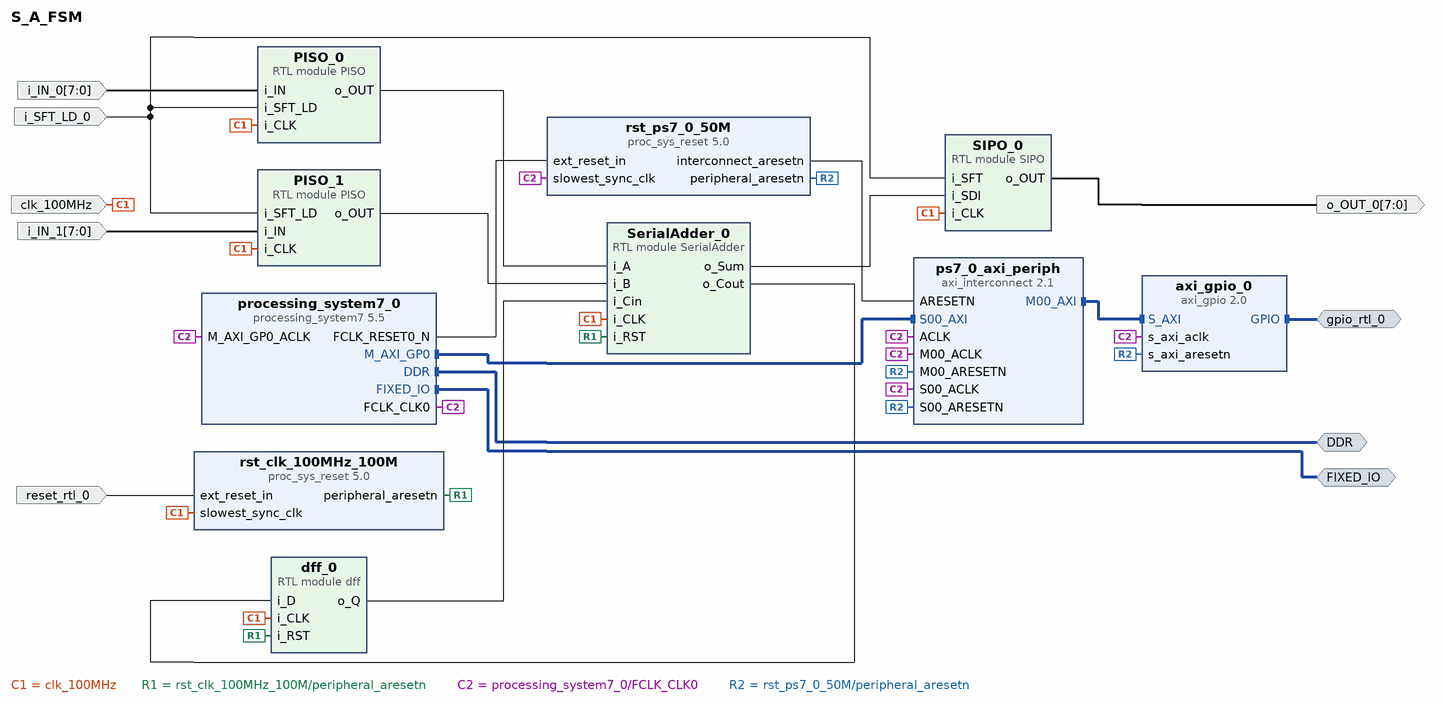
[diagram p0: block diagram of the top level]
# Vivado block design S_A_FSM, xc7z007sclg400-1, Vivado 2018.2
create_bd_design S_A_FSM

create_bd_intf_port -mode Master -vlnv xilinx.com:interface:gpio_rtl:1.0 gpio_rtl_0
create_bd_intf_port -mode Master -vlnv xilinx.com:interface:ddrx_rtl:1.0 DDR
create_bd_intf_port -mode Master -vlnv xilinx.com:display_processing_system7:fixedio_rtl:1.0 FIXED_IO
create_bd_port -dir I -type clk clk_100MHz
set_property -dict {CONFIG.FREQ_HZ 100000000} [get_bd_ports clk_100MHz]
create_bd_port -dir I -type rst reset_rtl_0
set_property -dict {CONFIG.POLARITY ACTIVE_LOW} [get_bd_ports reset_rtl_0]
create_bd_port -dir O -from 7 -to 0 o_OUT_0
create_bd_port -dir I -from 7 -to 0 i_IN_0
create_bd_port -dir I -from 7 -to 0 i_IN_1
create_bd_port -dir I i_SFT_LD_0

create_bd_cell -type ip -vlnv xilinx.com:ip:proc_sys_reset:5.0 rst_clk_100MHz_100M
create_bd_cell -type module -reference SIPO SIPO_0
create_bd_cell -type module -reference PISO PISO_0
create_bd_cell -type module -reference PISO PISO_1
create_bd_cell -type module -reference dff dff_0
create_bd_cell -type module -reference SerialAdder SerialAdder_0
create_bd_cell -type ip -vlnv xilinx.com:ip:axi_gpio:2.0 axi_gpio_0
create_bd_cell -type ip -vlnv xilinx.com:ip:processing_system7:5.5 processing_system7_0
create_bd_cell -type ip -vlnv xilinx.com:ip:axi_interconnect:2.1 ps7_0_axi_periph
set_property -dict {CONFIG.NUM_MI 1} [get_bd_cells ps7_0_axi_periph]
create_bd_cell -type ip -vlnv xilinx.com:ip:proc_sys_reset:5.0 rst_ps7_0_50M

# ---- connections ----

connect_bd_intf_net [get_bd_intf_pins processing_system7_0/M_AXI_GP0] [get_bd_intf_pins ps7_0_axi_periph/S00_AXI]
connect_bd_intf_net [get_bd_intf_pins ps7_0_axi_periph/M00_AXI] [get_bd_intf_pins axi_gpio_0/S_AXI]
connect_bd_intf_net [get_bd_intf_ports gpio_rtl_0] [get_bd_intf_pins axi_gpio_0/GPIO]
connect_bd_intf_net [get_bd_intf_ports DDR] [get_bd_intf_pins processing_system7_0/DDR]
connect_bd_intf_net [get_bd_intf_ports FIXED_IO] [get_bd_intf_pins processing_system7_0/FIXED_IO]
connect_bd_net [get_bd_ports clk_100MHz] \
  [get_bd_pins rst_clk_100MHz_100M/slowest_sync_clk] [get_bd_pins SIPO_0/i_CLK] [get_bd_pins PISO_0/i_CLK] \
  [get_bd_pins PISO_1/i_CLK] [get_bd_pins dff_0/i_CLK] [get_bd_pins SerialAdder_0/i_CLK]
connect_bd_net -net reset_rtl_0_1 [get_bd_ports reset_rtl_0] [get_bd_pins rst_clk_100MHz_100M/ext_reset_in]
connect_bd_net [get_bd_pins SerialAdder_0/o_Sum] [get_bd_pins SIPO_0/i_SDI]
connect_bd_net [get_bd_pins SIPO_0/o_OUT] [get_bd_ports o_OUT_0]
connect_bd_net [get_bd_pins PISO_0/o_OUT] [get_bd_pins SerialAdder_0/i_A]
connect_bd_net [get_bd_pins PISO_1/o_OUT] [get_bd_pins SerialAdder_0/i_B]
connect_bd_net -net i_IN_0_1 [get_bd_ports i_IN_0] [get_bd_pins PISO_0/i_IN]
connect_bd_net -net i_IN_1_1 [get_bd_ports i_IN_1] [get_bd_pins PISO_1/i_IN]
connect_bd_net -net i_SFT_LD_0_1 [get_bd_ports i_SFT_LD_0] [get_bd_pins PISO_1/i_SFT_LD] [get_bd_pins PISO_0/i_SFT_LD] [get_bd_pins SIPO_0/i_SFT]
connect_bd_net [get_bd_pins rst_clk_100MHz_100M/peripheral_aresetn] [get_bd_pins dff_0/i_RST] [get_bd_pins SerialAdder_0/i_RST]
connect_bd_net [get_bd_pins SerialAdder_0/o_Cout] [get_bd_pins dff_0/i_D]
connect_bd_net [get_bd_pins dff_0/o_Q] [get_bd_pins SerialAdder_0/i_Cin]
connect_bd_net [get_bd_pins processing_system7_0/FCLK_CLK0] \
  [get_bd_pins processing_system7_0/M_AXI_GP0_ACLK] [get_bd_pins ps7_0_axi_periph/S00_ACLK] \
  [get_bd_pins rst_ps7_0_50M/slowest_sync_clk] [get_bd_pins axi_gpio_0/s_axi_aclk] [get_bd_pins ps7_0_axi_periph/M00_ACLK] \
  [get_bd_pins ps7_0_axi_periph/ACLK]
connect_bd_net [get_bd_pins processing_system7_0/FCLK_RESET0_N] [get_bd_pins rst_ps7_0_50M/ext_reset_in]
connect_bd_net [get_bd_pins rst_ps7_0_50M/peripheral_aresetn] \
  [get_bd_pins ps7_0_axi_periph/S00_ARESETN] [get_bd_pins axi_gpio_0/s_axi_aresetn] \
  [get_bd_pins ps7_0_axi_periph/M00_ARESETN]
connect_bd_net [get_bd_pins rst_ps7_0_50M/interconnect_aresetn] [get_bd_pins ps7_0_axi_periph/ARESETN]

# ---- address map ----
assign_bd_address -offset 0x41200000 -range 64K -target_address_space [get_bd_addr_spaces processing_system7_0/Data] [get_bd_addr_segs axi_gpio_0/S_AXI/Reg]

validate_bd_design
save_bd_design
